# EAGLE design Adafruit Relay FeatherWing (EAGLE 6.6.0)
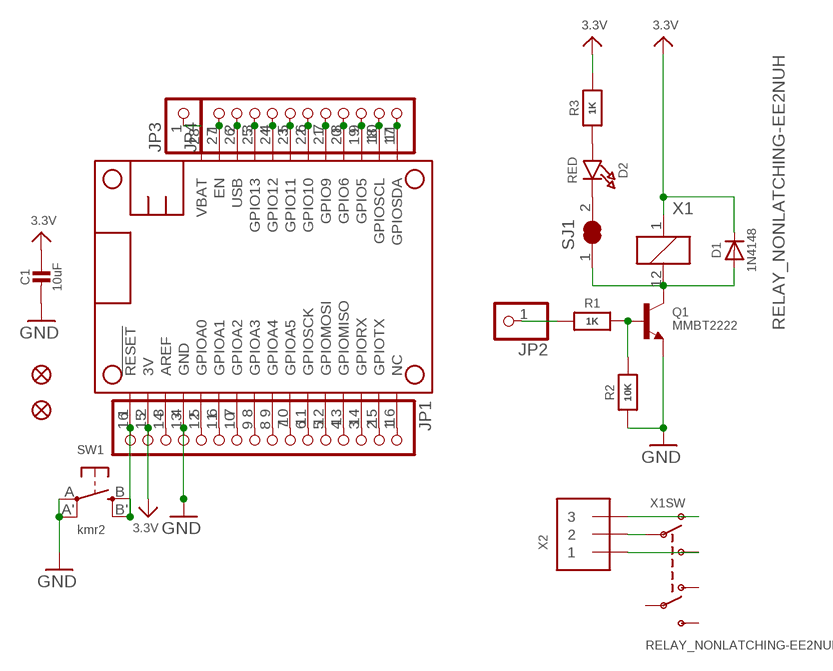
[diagram p0: schematic, sheet 1]

## Parts
C1  10uF  CAP_CERAMIC0805-NOOUTLINE  [0805-NO]
D1  1N4148  DIODESOD-323  [SOD-323]
D2  RED  LED0805_NOOUTLINE  [CHIPLED_0805_NOOUTLINE]
FID2  FIDUCIAL""  [FIDUCIAL_1MM]
FID3  FIDUCIAL""  [FIDUCIAL_1MM]
JP1  HEADER-1X16ROUND  [1X16_ROUND]
JP2  HEADER-1X1ROUND  [1X01_ROUND]
JP3  HEADER-1X1ROUND  [1X01_ROUND]
JP4  HEADER-1X11  [1X11_ROUND]
MS1  MICROSHIELD  [MICROSHIELD]
Q1  MMBT2222  TRANSISTOR_NPN  [SOT23-R]
R1  1K  RESISTOR0805_NOOUTLINE  [0805-NO]
R2  10K  RESISTOR0805_NOOUTLINE  [0805-NO]
R3  1K  RESISTOR0805_NOOUTLINE  [0805-NO]
SJ1  SOLDERJUMPER_CLOSED  [SOLDERJUMPER_CLOSEDWIRE]
SW1  kmr2  SWITCH_TACT_SMT4.6X2.8  [BTN_KMR2_4.6X2.8]
X1  RELAY_NONLATCHING-EE2NUH  [RELAY_EE2_NOLATCH]
X2  TERMBLOCK_1X3  [TERMBLOCK_1X3-3.5MM]

## Nets
3.3V: C1.1 D1.C JP1.15 MS1.2(3V) R3.2 X1.1
COM1 [HV]: X1.9(SW:P1) X2.2
GND: C1.2 JP1.13 MS1.4(GND) Q1.2(E) R2.1 SW1.A'(P1) SW1.A(P)
N$1: D1.A Q1.3(C) SJ1.1 X1.12
N$2: JP1.1 MS1.16(NC)
N$3: JP1.2 MS1.15(GPIOTX)
N$4: JP1.3 MS1.14(GPIORX)
N$5: JP1.4 MS1.13(GPIOMISO)
N$6: JP1.5 MS1.12(GPIOMOSI)
N$7: JP1.6 MS1.11(GPIOSCK)
N$8: JP1.7 MS1.10(GPIOA5)
N$9: JP1.8 MS1.9(GPIOA4)
N$10: JP1.9 MS1.8(GPIOA3)
N$11: JP1.10 MS1.7(GPIOA2)
N$12: JP1.11 MS1.6(GPIOA1)
N$13: JP1.12 MS1.5(GPIOA0)
N$14: JP4.1 MS1.27(EN)
N$15: JP4.3 MS1.25(GPIO13)
N$16: JP4.4 MS1.24(GPIO12)
N$17: JP4.5 MS1.23(GPIO11)
N$18: JP4.6 MS1.22(GPIO10)
N$19: JP4.7 MS1.21(GPIO9)
N$20: JP4.8 MS1.20(GPIO6)
N$21: JP4.9 MS1.19(GPIO5)
N$22: Q1.1(B) R1.2 R2.2
N$23: JP1.14 MS1.3(AREF)
N$24: JP2.1 R1.1
N$25: D2.C SJ1.2
N$26: D2.A R3.1
N$28 [HV]: X1.10(SW:O1) X2.3
NO1 [HV]: X1.8(SW:S1) X2.1
RESET: JP1.16 MS1.1(!RESET) SW1.B'(S1) SW1.B(S)
SCL: JP4.10 MS1.18(GPIOSCL)
SDA: JP4.11 MS1.17(GPIOSDA)
USB: JP4.2 MS1.26(USB)
VBAT: JP3.1 MS1.28(VBAT)
Unconnected: X1.3(SW:O2) X1.4(SW:P2) X1.5(SW:S2)

## Library data of the parts
C1 = microbuilder:CAP_CERAMIC: Ceramic Capacitors For new designs, use the packages preceded by an '_' character since they are more reliable: The following footprints should be used on most boards: _0402 - Standard footprint for regular board layouts _0603 - Standard footprint for regular board layouts _0805 - Standard footprint for regular board layouts _1206 - Standard footprint for regular board layouts For extremely tight-pitch boards where space is at a premium, the following 'micro-pitch' footprints can be used (smaller pads, no silkscreen outline, etc.): _0402MP - Micro-pitch footprint for very dense/compact boards _0603MP - Micro-pitch footprint for very dense/compact boards _0805MP - Micro-pitch footprint for very dense/compact boards _1206MP - Micro-pitch footprint for very dense/compact boards
D1 = microbuilder:DIODE: Diode SMA Model Volts Amps Type Vf Ir Digikey # Notes SSA34-E3 40V 3A Schottky 480mV @ 3A 200uA @ 40V SSA34-E3/61TGITR-ND CDBA120-G 20V 1A Schottky 500mV @ 1A 500uA @ 20V 641-1014-6-ND REEL MBRA210 10V 2A Schottky 350mV @ 2A 700uA @ 10V MBRA210LT3 SOD-123 Model Volts Amps Type Vf Ir Order # Notes BAT54T1G 30V 200mA Schottky 800mV @ 200mA 2uA @ 25V BAT54T1GOSTR-ND B0530W 30V 500mA Schottky 430mV @ 500mA 130uA @ 30V B0530W-FDICT-ND REEL MBR120 20V 1A Schottky 340mV @ 1A MBR120VLSFT1GOSCT-ND SOD-323 Model Volts Amps Type Vf Ir Order # Notes PMEG2005EJ 20V 500mA Schottky 355mV @ 500mA 568-4110-1-ND ZLLS410 10V 570mA Schottky 380mV @ 570mA ZLLS410CT-ND 1N4148WS 75V 150mA Silicon/Simple 1V 1N4148WSFSCT-ND REEL SOD-523 Model Volts Amps Type Vf Ir Order # Notes BAT54XV2 30V 200mA Schottky 0.8V @ 100mA BAT54XV2CT-ND TB751S 30V 30mA Schottky RB751S-40TE61CT-ND SOT23-R/W (R = Solder Paste/Reflow Ovens, W = Hand-Soldering) Model Volts Amps Type Vf Ir Order # Notes BAT54FILM 40V 300mA Schottky 497-7162-1-ND POWERDI-5 Model Volts Amps Type Vf Ir Order # Notes PDS560 60V 5A Schottky 670mV @ 5A 150uA @ 60V PDS560DICT-ND
D2 = microbuilder:LED: LED 0603 - 0603 Surface Mount Package 2mA: Green LED - Low Power (3.9mcd, 2ma, 1.7Vf) - Digikey: 475-2709-2-ND Orange LED - Low Power (9.8mcd, 2ma, 1.8Vf) - Digikey: 475-1194-2-ND Red LED - Low Power (5mcd, 2ma, 1.8Vf) - Digikey: 475-1195-2-ND Yellow LED - Low Power (7mcd, 2ma, 1.8Vf) - Digikey: 475-1196-2-ND 5mA: Blue LED - Low Power (17mcd, 5ma, 2.9Vf) - Digikey: LNJ937W8CRACT-ND 0805 - 0805 Surface Mount Package 2mA: Red LED (8.8mcd, 2mA, 1.8Vf, Clear) - Low Power [Digikey: 475-2510-1-ND] Green LED (5mcd, 2mA, 1.8Vf, Clear) - Low Power [Digikey: 475-2730-1-ND] Yellow LED (11.3mcd, 2mA, 1.8Vf, Clear) - Low Power [Digikey: 475-2555-1-ND] 20mA: Red LED (104mcd, 20mA, Diffused) - LS R976 [Digikey: 475-1278-6-ND] Red LED (12mcd, 20mA, 2.0Vf, Clear) - APT2012EC [Digikey: 754-1128-1-ND] Green LED (15mcd, 20mA, 2.2Vf, Clear) - APT2012GC [Digikey: 754-1131-1-ND] Orange LED (160mcd, 20mA, 2.1Vf, Clear) - APT2012SECK [Digikey: 754-1130-1-ND] 1206 - 1206 Surface Mount Package Green LED (26mcd, 20mA, Diffused) - LG N971 [Digikey: 475-1407-6-ND] Red LED (15mcd, 20mA, Diffused) - LH N974 [Digikey: 475-1416-6-ND] Cree - Cree High-Power Surface Mount LEDs XPEBWT-L1-0000-00D50 - White 111lm 350mA 2.9Vf 6200K 110° XTEAWT-00-0000-00000LEE3 - White 114lm 350mA 2.85Vf 5000K 115° Everlight - Everlight 45-21 Series Surface Mount LEDs 45-21/QK2C-B2832AC2CB2/2T - Warm White 2000mcd 20mA 3.25Vf 3050K 120° 45-21/LK2C-B38452C4CB2/2T - Nuetral White 2000mcd 20mA 3.25Vf 4150K 120° 45-21/LK2C-B50634C6CB2/2T - Cold White 2200mcd 20mA 3.25Vf 5650K 120° PLCC2 Reverse Mount LS T77K-J1L2-1-0-2-R18-Z - Red 11.25mcd 2mA 1.8Vf 630nm 120° LO T77K-L1M2-24-Z - Orange 19.6mcd 2mA 1.8Vf 606nm 120° LY T77K-K2M1-26-Z - Yellow 15.7mcd 2mA 1.8Vf 587nm 120°
FID2 FID3 = microbuilder:FIDUCIAL: Fiducial Alignment Points Various fiducial points for machine vision alignment.; BOM: EXCLUDE
JP1 = microbuilder:HEADER-1X16: PIN HEADER
JP2 JP3 = microbuilder:HEADER-1X1: PIN HEADER
JP4 = microbuilder:HEADER-1X11
MS1 = microbuilder:MICROSHIELD
Q1 = microbuilder:TRANSISTOR_NPN: NPN Transistor Transistor (NPN) 500mA 45V - BC817 [Digikey: 568-1631-1-ND] Transistor (NPN) 500mA 45V - BC817,215 [Mouser: 771-BC817-T/R] SOT23-R - SOT23 footprint optimised for use with solder paste and reflow ovens. SOT23-W - SOT23 footprint optimised for hand-soldering (larger pads).
R1-R3 = microbuilder:RESISTOR: Resistors For new designs, use the packages preceded by an '_' character since they are more reliable: The following footprints should be used on most boards: _0402 - Standard footprint for regular board layouts _0603 - Standard footprint for regular board layouts _0805 - Standard footprint for regular board layouts _1206 - Standard footprint for regular board layouts For extremely tight-pitch boards where space is at a premium, the following 'micro-pitch' footprints can be used (smaller pads, no silkscreen outline, etc.): _0402MP - Micro-pitch footprint for very dense/compact boards _0603MP - Micro-pitch footprint for very dense/compact boards _0805MP - Micro-pitch footprint for very dense/compact boards _1206MP - Micro-pitch footprint for very dense/compact boards
SJ1 = microbuilder:SOLDERJUMPER_CLOSED: Solder Jumper - Closed These solder jumpers are closed by default CLOSEDWIRE - 10 mil trace between pads that can be cut and resoldered later CLOSEDPERM - 63 mil trace between pads for a permanent connection (used to 'bridge' two signals, a shameless hack for Eagle). Can double as a test point as well (no cream layer)
SW1 = microbuilder:SWITCH_TACT_SMT: SMT Tact Switches 6x6mm - Digikey: P12940SCT-ND KMR2 (4.6x2.8mm) - Digikey: 401-1426-1-ND EVQ-PQHB55 - Light Touch, 160GF (4.5x4.5mm) - Digikey: P8090SCT-ND KMT0 - KMT021 NGJ LHS (etc.) IP68/Waterproof - Digikey: CKN10289CT-ND
X1 = microbuilder:RELAY_NONLATCHING
X2 = microbuilder:TERMBLOCK_1X3: 3.5mm Terminal block http://www.ladyada.net/library/pcb/eaglelibrary.html

## Net classes
1 HV: width 0.406 mm, drill 0.381 mm, clearance 1.016 mm

## Board
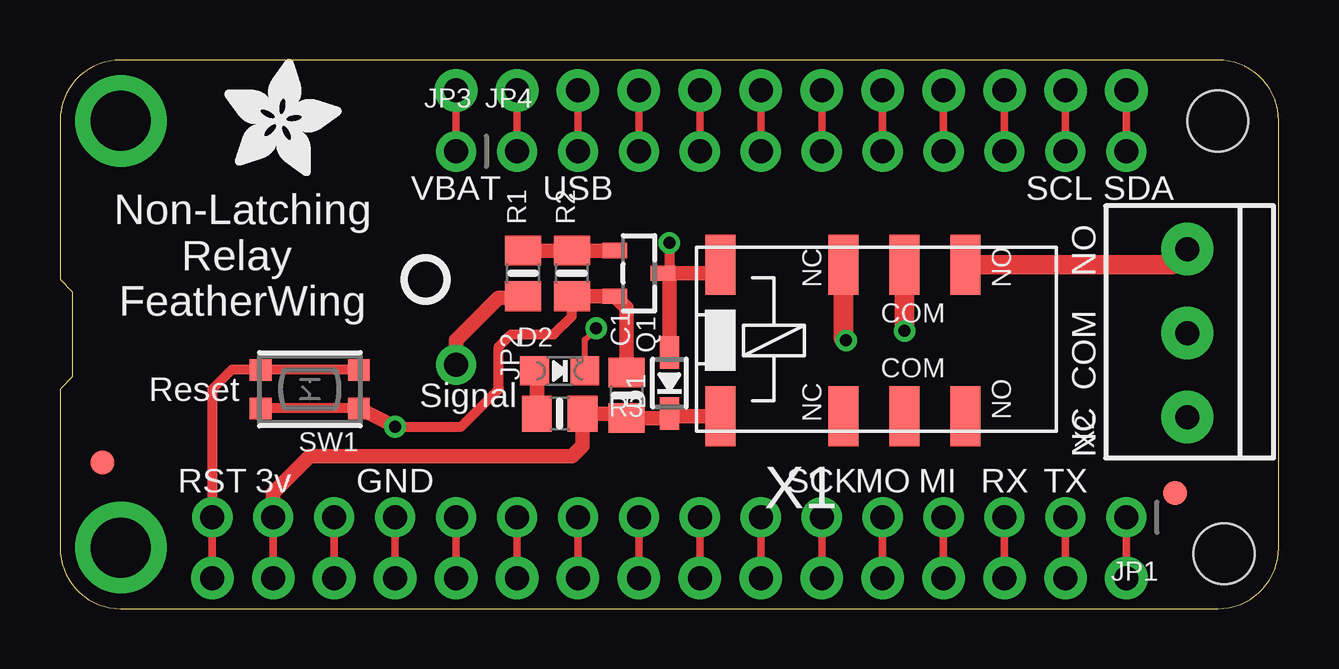
[diagram p1: board, top side]
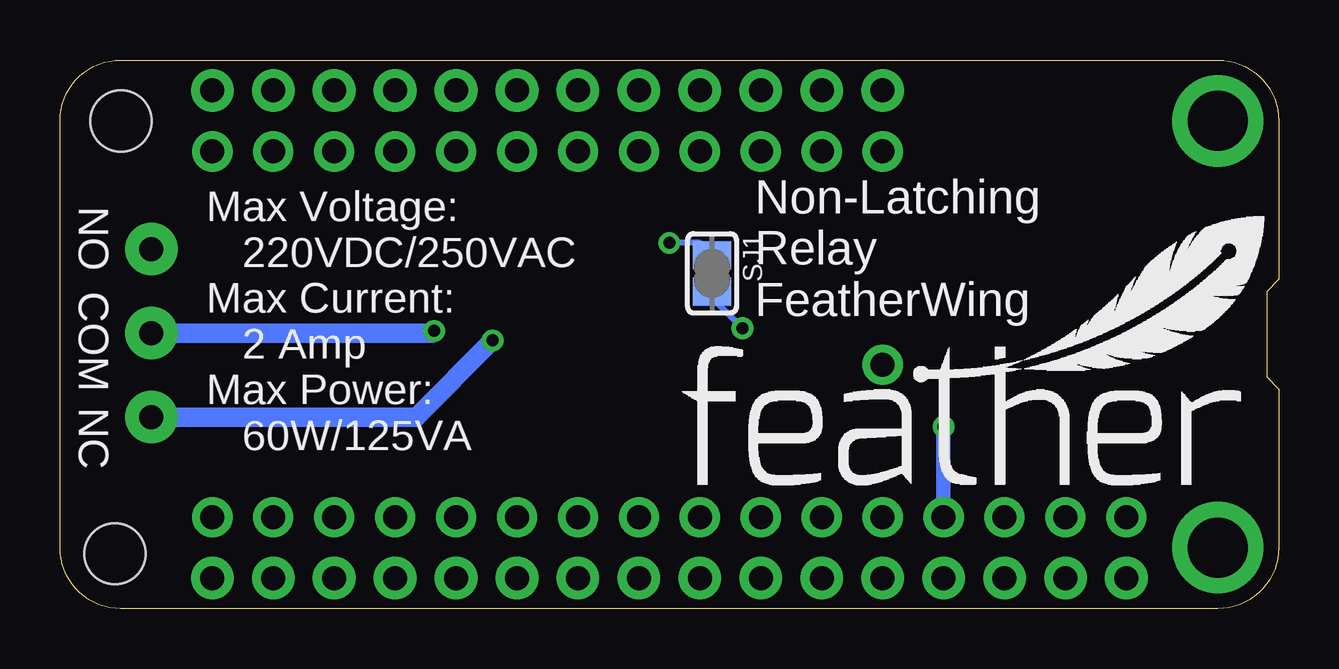
[diagram p2: board, bottom side, seen from below]

Size 50.8 x 22.86 mm. Coordinates in mm from the lower left corner, seen from the top.
Copper layers (1*16): Top 0.035mm / dielectric 1.5mm / Bottom 0.035mm
Design rules "adafruit": minimum track width 8mil, minimum drill 15.5mil, track to track 8mil, track to pad 8mil, pad to pad 8mil, via to via 8mil, smd to smd 8mil, copper to edge 10mil, drill to drill 8mil, minimum pad ring 10mil, minimum via ring 8mil, stop-mask expansion 2mil, vias tented up to drill 20mil, thermal gap 10mil

### Footprints (pad centres in the part's own frame; a part is rotated, then mirrored left to right if it is on the bottom)
0805-NO = smd 1.24 x 1.5: 1 -0.95,0; 2 0.95,0
SOD-323 = smd 1.35 x 0.8: A 1.27,0; C -1.27,0
CHIPLED_0805_NOOUTLINE = smd 1.2 x 1.2: A 0,-1.05; C 0,1.05
FIDUCIAL_1MM = smd 1 x 1: 1 0,0
1X16_ROUND = drill 1 pad 1.676: 1 -19.05,0; 2 -16.51,0; 3 -13.97,0; 4 -11.43,0; 5 -8.89,0; 6 -6.35,0; 7 -3.81,0; 8 -1.27,0; 9 1.27,0; 10 3.81,0; 11 6.35,0; 12 8.89,0; 13 11.43,0; 14 13.97,0; 15 16.51,0; 16 19.05,0
1X01_ROUND = drill 1 pad 1.676: 1 0,0
1X11_ROUND = drill 1 pad 1.676: 1 -12.7,0; 2 -10.16,0; 3 -7.62,0; 4 -5.08,0; 5 -2.54,0; 6 0,0; 7 2.54,0; 8 5.08,0; 9 7.62,0; 10 10.16,0; 11 12.7,0
MICROSHIELD = drill 1 pad 1.778: 1 6.35,1.27; 2 8.89,1.27; 3 11.43,1.27; 4 13.97,1.27; 5 16.51,1.27; 6 19.05,1.27; 7 21.59,1.27; 8 24.13,1.27; 9 26.67,1.27; 10 29.21,1.27; 11 31.75,1.27; 12 34.29,1.27; 13 36.83,1.27; 14 39.37,1.27; 15 41.91,1.27; 16 44.45,1.27; 17 44.45,21.59; 18 41.91,21.59; 19 39.37,21.59; 20 36.83,21.59; 21 34.29,21.59; 22 31.75,21.59; 23 29.21,21.59; 24 26.67,21.59; 25 24.13,21.59; 26 21.59,21.59; 27 19.05,21.59; 28 16.51,21.59 | drill 2.5 pad 3.81: P$1 2.54,20.32; P$2 2.54,2.54 | hole 2.54: 48.26,20.32; 48.514,2.286
SOT23-R = smd 0.635 x 1.016: 1 -0.95,-1; 2 0.95,-1; 3 0,1
SOLDERJUMPER_CLOSEDWIRE = smd 1.168 x 1.6: 1 -0.762,0; 2 0.762,0 | smd 0.635 x 0.203: WIRE 0,0
BTN_KMR2_4.6X2.8 = smd 0.9 x 0.9: A 2.05,0.8; A' -2.05,0.8; B 2.05,-0.8; B' -2.05,-0.8
RELAY_EE2_NOLATCH = smd 1.25 x 2.5: 1 -6.5,-3.15; 3 -1.37,-3.15; 4 1.17,-3.15; 5 3.71,-3.15; 8 3.71,3.15; 9 1.17,3.15; 10 -1.37,3.15; 12 -6.5,3.15
TERMBLOCK_1X3-3.5MM = drill 1 pad 2.184: 1 3.55,0; 2 0.05,0; 3 -3.45,0

### Placement (x,y rotation side)
C1  23.62,8.89 90 top
D1  25.4,9.4 90 top
D2  20.83,9.91 270 top
FID2  1.78,6.1 0 top
FID3  46.48,4.83 0 top
JP1  25.4,3.81 180 top
JP2  16.51,10.16 270 top
JP3  16.51,19.05 0 top
JP4  31.75,19.05 0 top
MS1  0,0 0 top
Q1  24.13,13.97 270 top
R1  19.3,13.97 90 top
R2  21.34,13.97 90 top
R3  20.83,8.13 0 top
SJ1  23.62,13.97 270 bottom
SW1  10.41,9.14 180 top
U$5  [PCBFEAT-REV-040]  15.24,13.72 0 top
U$6  [FEATHERLOGO]  24.89,5.08 0 bottom
U$7  [ADAFRUIT_5MM]  6.86,18.03 0 top
X1  34.04,11.18 0 top
X2  46.99,11.43 90 top

### Tracks (layer width: path | path; a pad name or v marks a point on that pad's centre or on a via)
3.3V
  Top 0.305: JP1.15 MS1.2
  Top 0.61: X1.1 25.4,8.03 D1.C 25.4,7.94 C1.1 23.62,8.13 R3.2 21.78,6.79 21.34,6.35 10.41,6.35 8.89,4.83 JP1.15
COM1  (via drill 0.5)
  Top 0.813: X1.9 v35.21,11.57
  Bottom 0.813: v35.21,11.57 35.3,11.48 X2.2
GND  (via drill 0.5)
  Top 0.305: MS1.4 JP1.13
  Top 0.406: v13.97,7.58 16.73,7.58 18.29,9.14 18.29,10.92 18.8,11.43 20.57,11.43 21.34,12.19 R2.1 | SW1.A' SW1.A
  Top 0.61: C1.2 23.62,12.53 Q1.2 R2.1 | v13.97,7.58 SW1.A'
  Bottom 0.61: JP1.13 v13.97,7.58
N$1  (via drill 0.5)
  Top 0.406: v25.4,15.24 25.4,14.22 25.65,13.97
  Top 0.61: X1.12 27.18,13.97 25.65,13.97 Q1.3 25.4,13.97 D1.A
  Bottom 0.254: SJ1.1 24.13,15.24 v25.4,15.24
N$2
  Top 0.305: JP1.1 MS1.16
N$3
  Top 0.305: JP1.2 MS1.15
N$4
  Top 0.305: MS1.14 JP1.3
N$5
  Top 0.305: JP1.4 MS1.13
N$6
  Top 0.305: MS1.12 JP1.5
N$7
  Top 0.305: JP1.6 MS1.11
N$8
  Top 0.305: MS1.10 JP1.7
N$9
  Top 0.305: MS1.9 JP1.8
N$10
  Top 0.305: JP1.9 MS1.8
N$11
  Top 0.305: MS1.7 JP1.10
N$12
  Top 0.305: MS1.6 JP1.11
N$13
  Top 0.305: MS1.5 JP1.12
N$14
  Top 0.305: JP4.1 MS1.27
N$15
  Top 0.305: JP4.3 MS1.25
N$16
  Top 0.305: JP4.4 MS1.24
N$17
  Top 0.305: JP4.5 MS1.23
N$18
  Top 0.305: JP4.6 MS1.22
N$19
  Top 0.305: JP4.7 MS1.21
N$20
  Top 0.305: JP4.8 MS1.20
N$21
  Top 0.305: JP4.9 MS1.19
N$22
  Top 0.61: Q1.1 R2.2 R1.2
N$23
  Top 0.305: MS1.3 JP1.14
N$24
  Top 0.61: JP2.1 16.51,11.18 18.29,12.95 19.24,12.95 R1.1
N$25  (via drill 0.5)
  Top 0.254: D2.C 21.88,11.21 v22.35,11.68
  Bottom 0.254: v22.35,11.68 23.62,12.95 SJ1.2
N$26
  Top 0.61: R3.1 19.88,9.55 D2.A
N$28  (via drill 0.5)
  Top 0.813: X1.10 32.67,11.28 v32.77,11.18
  Bottom 0.813: v32.77,11.18 35.96,7.98 X2.3
NO1
  Top 0.813: X2.1 46.34,14.33 X1.8
RESET
  Top 0.305: JP1.16 MS1.1
  Top 0.406: SW1.B' SW1.B 7.15,9.94 6.35,9.14 JP1.16
SCL
  Top 0.305: JP4.10 MS1.18
SDA
  Top 0.305: MS1.17 JP4.11
USB
  Top 0.305: JP4.2 MS1.26
VBAT
  Top 0.305: MS1.28 JP3.1

### Text on the board
tPlace: VBAT | USB | SCL | SDA | NO | Non-Latching / Relay / FeatherWing | COM | Reset | Signal | NC | RST | 3v | GND | SCK | MO | MI | RX | TX
bPlace: NO | COM | Non-Latching / Relay / FeatherWing | NC | Max Voltage: / 220VDC/250VAC / Max Current: / 2 Amp / Max Power: / 60W/125VA